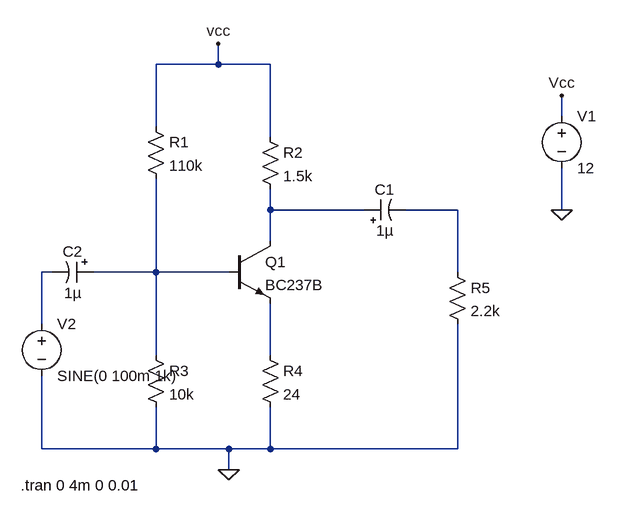
[diagram p0: schematic PowAmp_05_02_01_class_A.asc]
PowAmp_05_02_01_class_A.asc, the LTspice schematic file:
Version 4
SHEET 1 880 680
WIRE 64 -32 64 -64
WIRE 64 -32 -32 -32
WIRE 144 -32 64 -32
WIRE 592 48 592 16
WIRE -32 64 -32 -32
WIRE 144 80 144 -32
WIRE 144 192 144 160
WIRE 288 192 144 192
WIRE 432 192 352 192
WIRE 592 192 592 128
WIRE 144 240 144 192
WIRE -192 288 -208 288
WIRE -32 288 -32 144
WIRE -32 288 -128 288
WIRE 80 288 -32 288
WIRE 432 288 432 192
WIRE -208 368 -208 288
WIRE -32 416 -32 288
WIRE 144 416 144 336
WIRE -208 560 -208 448
WIRE -32 560 -32 496
WIRE -32 560 -208 560
WIRE 80 560 -32 560
WIRE 144 560 144 496
WIRE 144 560 80 560
WIRE 432 560 432 368
WIRE 432 560 144 560
WIRE 80 592 80 560
FLAG 592 192 0
FLAG 80 592 0
FLAG 592 16 Vcc
FLAG 64 -64 vcc
SYMBOL res -48 48 R0
SYMATTR InstName R1
SYMATTR Value 110k
SYMBOL res 128 64 R0
SYMATTR InstName R2
SYMATTR Value 1.5k
SYMBOL res -48 400 R0
SYMATTR InstName R3
SYMATTR Value 10k
SYMBOL res 128 400 R0
SYMATTR InstName R4
SYMATTR Value 24
SYMBOL res 416 272 R0
SYMATTR InstName R5
SYMATTR Value 2.2k
SYMBOL voltage 592 32 R0
WINDOW 123 0 0 Left 2
WINDOW 39 0 0 Left 2
SYMATTR InstName V1
SYMATTR Value 12
SYMBOL voltage -208 352 R0
WINDOW 123 0 0 Left 2
WINDOW 39 0 0 Left 2
SYMATTR InstName V2
SYMATTR Value SINE(0 100m 1k)
SYMBOL polcap 288 208 R270
WINDOW 0 32 32 VTop 2
WINDOW 3 0 32 VBottom 2
SYMATTR InstName C1
SYMATTR Value 1µ
SYMBOL polcap -128 272 R90
WINDOW 0 0 32 VBottom 2
WINDOW 3 32 32 VTop 2
SYMATTR InstName C2
SYMATTR Value 1µ
SYMBOL npn2 80 240 R0
SYMATTR InstName Q1
SYMATTR Value BC237B
TEXT -240 616 Left 2 !.tran 0 4m 0 0.01

The netlist it stands for:
* PowAmp_05_02_01_class_A.asc
R1 Vcc N004 110k
R2 Vcc N001 1.5k
R3 N004 0 10k
R4 N005 0 24
R5 N002 0 2.2k
V1 Vcc 0 12
V2 N003 0 SINE(0 100m 1k)
C1 N001 N002 1µ
C2 N004 N003 1µ
Q1 N001 N004 N005 0 BC237B
.model NPN NPN
.model PNP PNP
.lib standard.bjt
.tran 0 4m 0 0.01
.backanno
.end